# EAGLE schematic PCB (beta) (EAGLE 7.7.0)

## Sheet 1 of 12

## Sheet 2 of 12
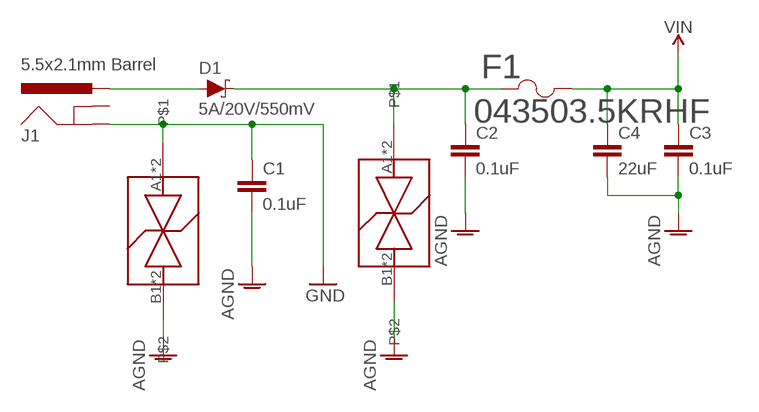
[diagram p0: schematic, sheet 2]

### Parts
C1  0.1uF  0.1UF-0603-25V-(+80/-20%)  [0603]
C2  0.1uF  0.1UF-0603-25V-(+80/-20%)  [0603]
C3  0.1uF  0.1UF-0603-25V-(+80/-20%)  [0603]
C4  22uF  22UF-0805-6.3V-20%  [0805]
D1  5A/20V/550mV  DIODE-SCHOTTKY-B340A  [SMA-DIODE]
F1  043503.5KRHF  [0435SERIES]
J1  5.5x2.1mm Barrel  POWER_JACKSMD  [POWER_JACK_SMD]
U$2  LFTVS18-1F3_FLIPCHIP  [4-UFBGA]
U$3  LFTVS18-1F3_FLIPCHIP  [4-UFBGA]

### Nets
+VDC_IN_F: C2.1 D1.C F1.1
+VDC_IN_F_D: D1.A J1.VIN0(PWR)
AGND: C1.2 C2.2 C3.2 C4.2 ; also sheet 7,8,9,12
GND: C1.1 J1.P$4(GND) ; also sheet 3,4,5,6,7,9
VIN: C3.1 C4.1 F1.2
Unconnected: J1.GND(GNDBREAK) U$2.A1 U$2.A2 U$2.B1 U$2.B2 U$3.A1 U$3.A2 U$3.B1 U$3.B2

## Sheet 3 of 12
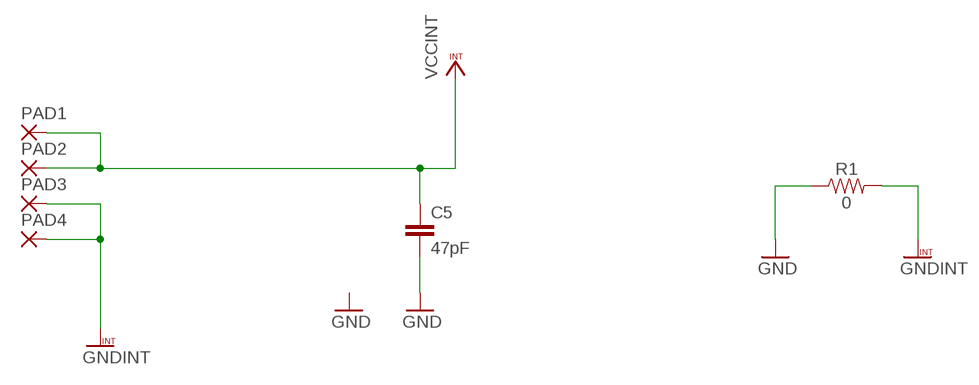
[diagram p1: schematic, sheet 3]

### Parts
C5  47pF  47PF-0603-50V-5%  [0603]
PAD1  2,54/1,0  [2,54/1,0]
PAD2  2,54/1,0  [2,54/1,0]
PAD3  2,54/1,0  [2,54/1,0]
PAD4  2,54/1,0  [2,54/1,0]
R1  0  0OHM-0603-1/10W-5%  [0603]

### Nets
GND: C5.2 R1.1 ; also sheet 2,4,5,6,7,9
GNDINT: PAD3.1(P) PAD4.1(P) R1.2
VCCINT: C5.1 PAD1.1(P) PAD2.1(P)

## Sheet 4 of 12
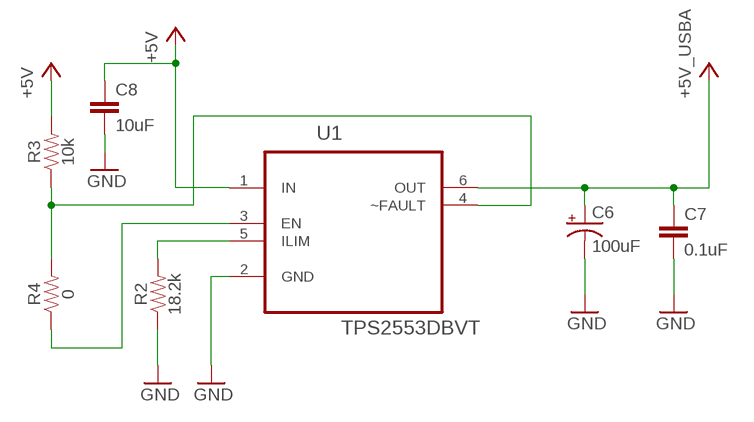
[diagram p2: schematic, sheet 4]

### Parts
C6  100uF  100UF-POLAR-EIA7343-10V-10%(TANT)  [EIA7343]
C7  0.1uF  0.1UF-0603-25V-(+80/-20%)  [0603]
C8  10uF  10UF-0603-6.3V-20%  [0603]
R2  18.2k  1.8KOHM-0603-1/10W-1%  [0603]
R3  10k  10KOHM-0603-1/10W-1%  [0603]
R4  0  0OHM-0603-1/10W-5%  [0603]
U1  TPS2553DBVT  [SOT95P280X145-6N]

### Nets
+5V: C6.A(+) C7.1 C8.1 R3.2 U1.1(IN) U1.6(OUT) ; supply symbol labelled +5V_USBA ; also sheet 9
GND: C6.C(-) C7.2 C8.2 R2.1 U1.2(GND) ; also sheet 2,3,5,6,7,9
N$5: R2.2 U1.5(ILIM)
USB3_CONN_EN: R4.1 U1.3(EN)
USB3_CONN_FLT: R3.1 R4.2 U1.4(~FAULT)

## Sheet 5 of 12
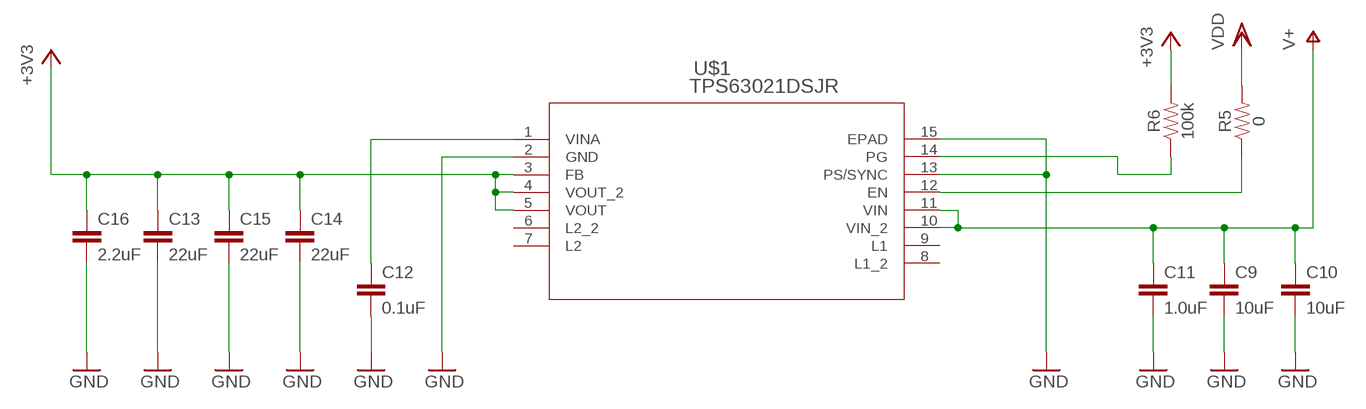
[diagram p3: schematic, sheet 5]

### Parts
C9  10uF  10UF-0603-6.3V-20%  [0603]
C10  10uF  10UF-0603-6.3V-20%  [0603]
C11  1.0uF  1.0UF-0603-16V-10%  [0603]
C12  0.1uF  0.1UF-0603-25V-(+80/-20%)  [0603]
C13  22uF  22UF-0805-6.3V-20%  [0805]
C14  22uF  22UF-0805-6.3V-20%  [0805]
C15  22uF  22UF-0805-6.3V-20%  [0805]
C16  2.2uF  2.2UF-0603-10V-20%  [0603]
R5  0  0OHM-0603-1/10W-5%  [0603]
R6  100k  100KOHM-0603-1/10W-1%  [0603]
U$1  TPS63021DSJR  [DSJ14_2P85X1P58]

### Nets
+3V3: C13.1 C14.1 C15.1 C16.1 R6.2 U$1.3(FB) U$1.4(VOUT_2) U$1.5(VOUT) ; also sheet 7,9
GND: C9.2 C10.2 C11.2 C12.2 C13.2 C14.2 C15.2 C16.2 U$1.2(GND) U$1.13(PS/SYNC) U$1.15(EPAD) ; also sheet 2,3,4,6,7,9
N$1: R5.1 U$1.12(EN)
N$2: R6.1 U$1.14(PG)
N$3: C12.1 U$1.1(VINA)
V+: C9.1 C10.1 C11.1 U$1.10(VIN_2) U$1.11(VIN)
VDD: R5.2
Unconnected: U$1.6(L2_2) U$1.7(L2) U$1.8(L1_2) U$1.9(L1)

## Sheet 6 of 12
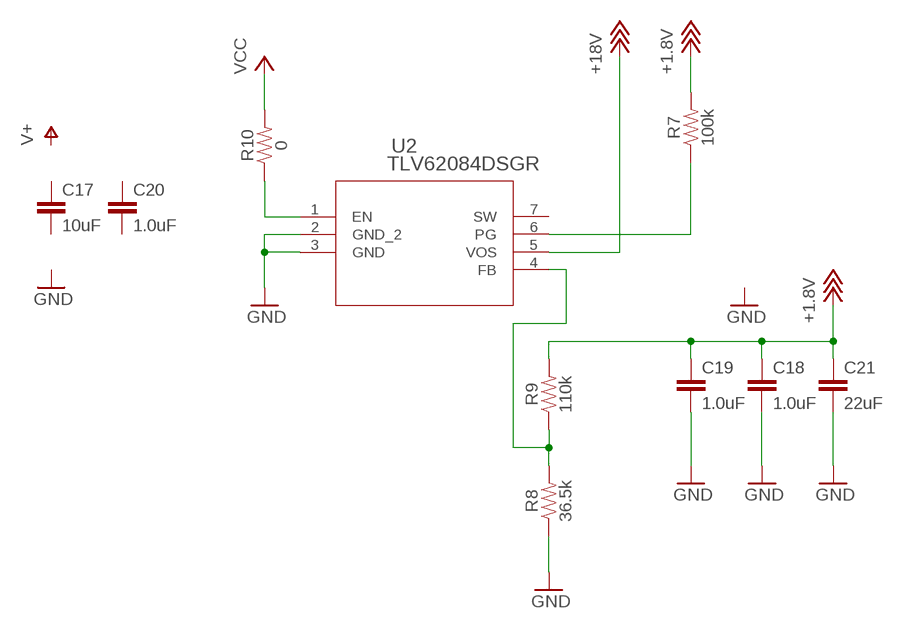
[diagram p4: schematic, sheet 6]

### Parts
C17  10uF  10UF-0603-6.3V-20%  [0603]
C18  1.0uF  1.0UF-0603-16V-10%  [0603]
C19  1.0uF  1.0UF-0603-16V-10%  [0603]
C20  1.0uF  1.0UF-0603-16V-10%  [0603]
C21  22uF  22UF-0805-6.3V-20%  [0805]
R7  100k  100KOHM-0603-1/10W-1%  [0603]
R8  36.5k  2.2OHM-0603-1/10W-5%  [0603]
R9  110k  100KOHM-0603-1/10W-1%  [0603]
R10  0  0OHM-0603-1/10W-5%  [0603]
U2  TLV62084DSGR  [DSG8_0P9X1P6]

### Nets
+18V: C18.1 C19.1 C21.1 R7.2 R9.2 U2.5(VOS) ; supply symbol labelled +1.8V ; also sheet 9
EN_1P8V: R10.1 U2.1(EN)
FB_1P8V: R8.2 R9.1 U2.4(FB)
GND: C18.2 C19.2 C21.2 R8.1 U2.2(GND_2) U2.3(GND) ; also sheet 2,3,4,5,7,9
PWRGOOD_1P8V: R7.1 U2.6(PG)
VCC: R10.2
Unconnected: C17.1 C17.2 C20.1 C20.2 U2.7(SW)

## Sheet 7 of 12
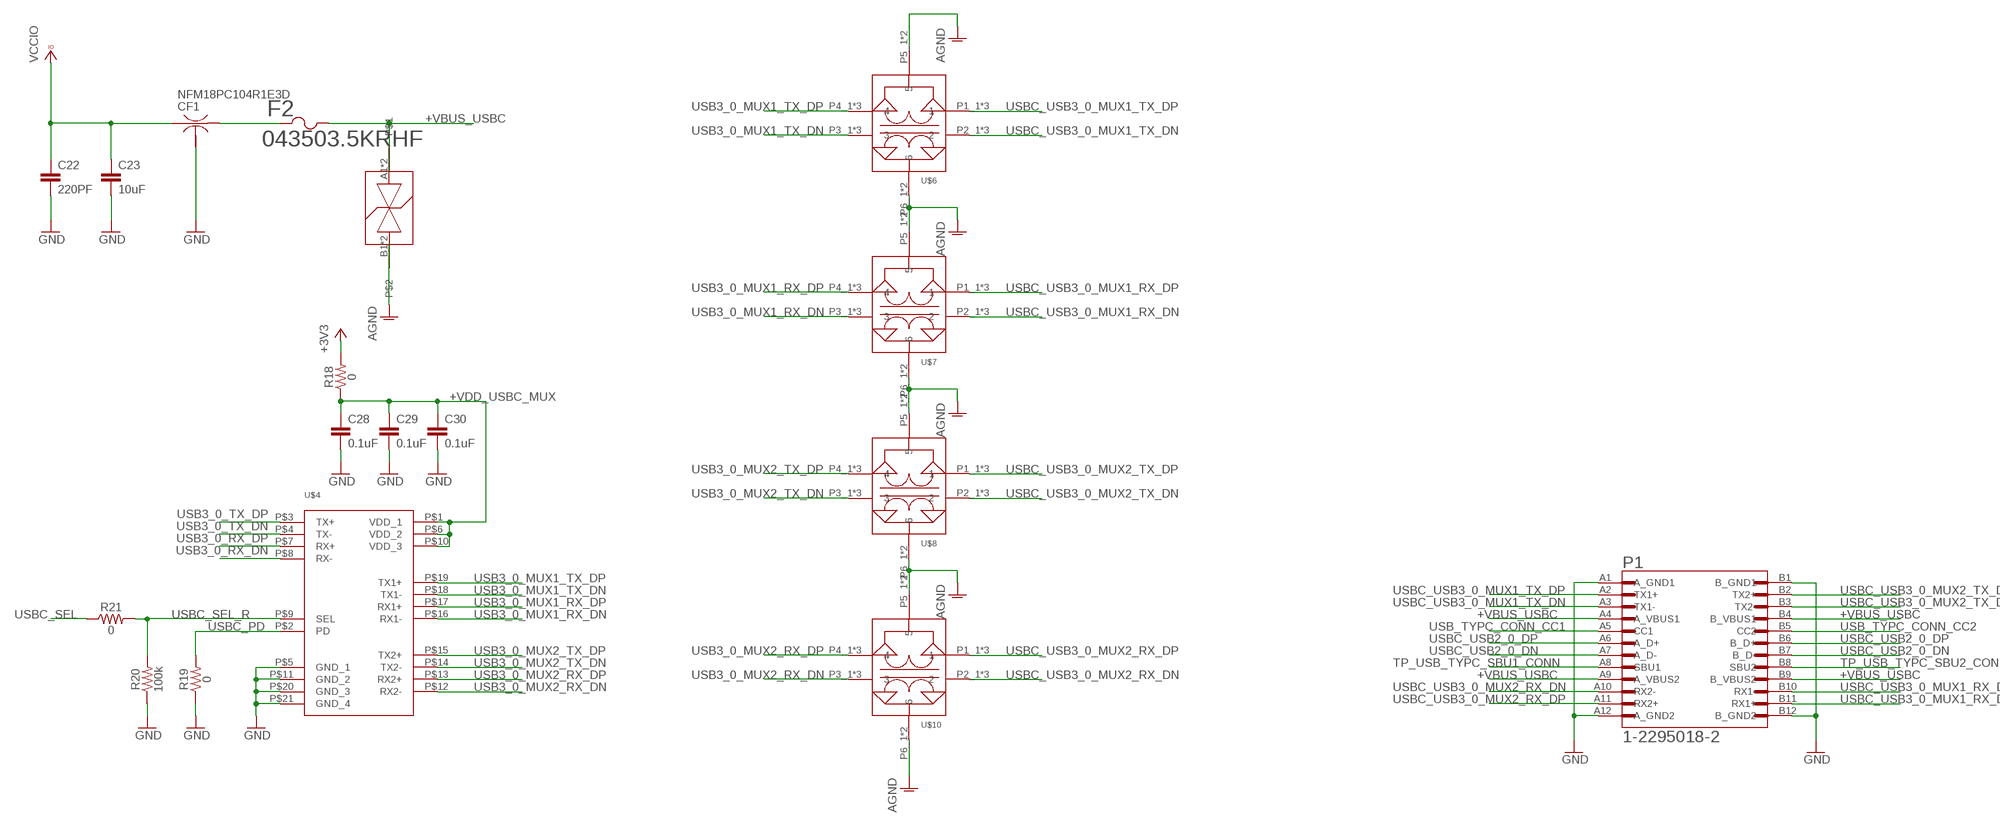
[diagram p5: schematic, sheet 7]

### Parts
C22  220PF  270PF-0603-50V-5%  [0603]
C23  10uF  10UF-0603-6.3V-20%  [0603]
C28  0.1uF  0.1UF-0603-25V-(+80/-20%)  [0603]
C29  0.1uF  0.1UF-0603-25V-(+80/-20%)  [0603]
C30  0.1uF  0.1UF-0603-25V-(+80/-20%)  [0603]
CF1  NFM18PC104R1E3D  NFM21C  [NFM21C]
F2  043503.5KRHF  [0435SERIES]
P1  1-2295018-2  [TE_1-2295018-2]
R18  0  0OHM-0603-1/10W-5%  [0603]
R19  0  0OHM-0603-1/10W-5%  [0603]
R20  100k  100KOHM-0603-1/10W-1%  [0603]
R21  0  0OHM-0603-1/10W-5%  [0603]
U$4  PI3USB302-AZBEX_ANALOG_SWITCH  [20-TQFP]
U$5  LFTVS18-1F3_FLIPCHIP  [4-UFBGA]
U$6  TCE0806S-350-2P-T200  [0302_(0806_METRIC)]
U$7  TCE0806S-350-2P-T200  [0302_(0806_METRIC)]
U$8  TCE0806S-350-2P-T200  [0302_(0806_METRIC)]
U$10  TCE0806S-350-2P-T200  [0302_(0806_METRIC)]

### Nets
+3V3: R18.2 ; also sheet 5,9
+VBUS_USBC: F2.2 P1.A4(A_VBUS1) P1.A9(A_VBUS2) P1.B4(B_VBUS1) P1.B9(B_VBUS2) U$5.A1 U$5.A2
+VBUS_USBC_F: CF1.3 F2.1
+VDD_USBC_MUX: C28.1 C29.1 C30.1 R18.1 U$4.P$1(VDD_1) U$4.P$6(VDD_2) U$4.P$10(VDD_3)
AGND: U$5.B1 U$5.B2 U$6.P5_1 U$6.P5_2 U$6.P6_1 U$6.P6_2 U$7.P5_1 U$7.P5_2 U$7.P6_1 U$7.P6_2 U$8.P5_1 U$8.P5_2 U$8.P6_1 U$8.P6_2 U$10.P5_1 U$10.P5_2 U$10.P6_1 U$10.P6_2 ; also sheet 2,8,9,12
GND: C22.2 C23.2 C28.2 C29.2 C30.2 CF1.2@1 P1.A1(A_GND1) P1.A12(A_GND2) P1.B1(B_GND1) P1.B12(B_GND2) R19.1 R20.1 U$4.P$5(GND_1) U$4.P$11(GND_2) U$4.P$20(GND_3) U$4.P$21(GND_4) ; also sheet 2,3,4,5,6,9
TP_USB_TYPC_SBU1_CONN: P1.A8(SBU1)
TP_USB_TYPC_SBU2_CONN: P1.B8(SBU2)
USB3_0_MUX1_RX_DN: U$4.P$16(RX1-) U$7.P3_1 U$7.P3_2 U$7.P3_3
USB3_0_MUX1_RX_DP: U$4.P$17(RX1+) U$7.P4_1 U$7.P4_2 U$7.P4_3
USB3_0_MUX1_TX_DN: U$4.P$18(TX1-) U$6.P3_1 U$6.P3_2 U$6.P3_3
USB3_0_MUX1_TX_DP: U$4.P$19(TX1+) U$6.P4_1 U$6.P4_2 U$6.P4_3
USB3_0_MUX2_RX_DN: U$4.P$12(RX2-) U$10.P3_1 U$10.P3_2 U$10.P3_3
USB3_0_MUX2_RX_DP: U$4.P$13(RX2+) U$10.P4_1 U$10.P4_2 U$10.P4_3
USB3_0_MUX2_TX_DN: U$4.P$14(TX2-) U$8.P3_1 U$8.P3_2 U$8.P3_3
USB3_0_MUX2_TX_DP: U$4.P$15(TX2+) U$8.P4_1 U$8.P4_2 U$8.P4_3
USB3_0_RX_DN: U$4.P$8(RX-)
USB3_0_RX_DP: U$4.P$7(RX+)
USB3_0_TX_DN: U$4.P$4(TX-)
USB3_0_TX_DP: U$4.P$3(TX+)
USB_TYPC_CONN_CC1: P1.A5(CC1)
USB_TYPC_CONN_CC2: P1.B5(CC2)
USBC_PD: R19.2 U$4.P$2(PD)
USBC_SEL: R21.1
USBC_SEL_R: R20.2 R21.2 U$4.P$9(SEL)
USBC_USB2_0_DN: P1.A7(A_D-) P1.B7(B_D-)
USBC_USB2_0_DP: P1.A6(A_D+) P1.B6(B_D+)
USBC_USB3_0_MUX1_RX_DN: P1.B10(RX1-) U$7.P2_1 U$7.P2_2 U$7.P2_3
USBC_USB3_0_MUX1_RX_DP: P1.B11(RX1+) U$7.P1_1 U$7.P1_2 U$7.P1_3
USBC_USB3_0_MUX1_TX_DN: P1.A3(TX1-) U$6.P2_1 U$6.P2_2 U$6.P2_3
USBC_USB3_0_MUX1_TX_DP: P1.A2(TX1+) U$6.P1_1 U$6.P1_2 U$6.P1_3
USBC_USB3_0_MUX2_RX_DN: P1.A10(RX2-) U$10.P2_1 U$10.P2_2 U$10.P2_3
USBC_USB3_0_MUX2_RX_DP: P1.A11(RX2+) U$10.P1_1 U$10.P1_2 U$10.P1_3
USBC_USB3_0_MUX2_TX_DN: P1.B3(TX2-) U$8.P2_1 U$8.P2_2 U$8.P2_3
USBC_USB3_0_MUX2_TX_DP: P1.B2(TX2+) U$8.P1_1 U$8.P1_2 U$8.P1_3
VCCIO: C22.1 C23.1 CF1.1
Unconnected: CF1.2@2

## Sheet 8 of 12
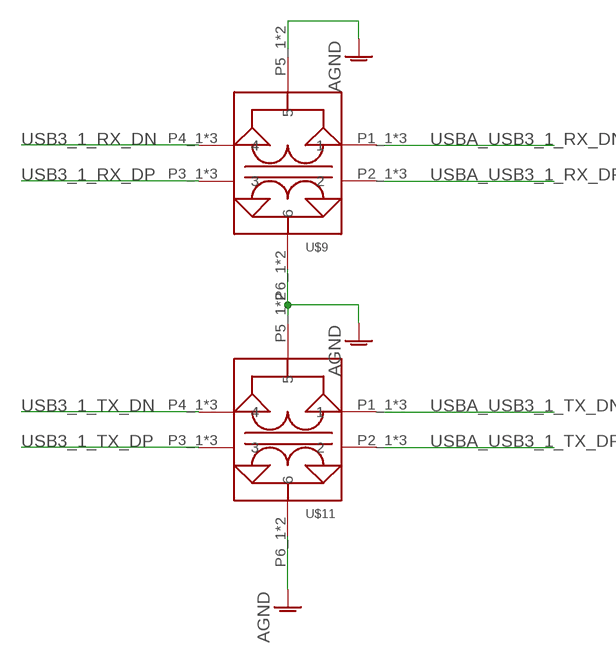
[diagram p6: schematic, sheet 8]

### Parts
U$9  TCE0806S-350-2P-T200  [0302_(0806_METRIC)]
U$11  TCE0806S-350-2P-T200  [0302_(0806_METRIC)]

### Nets
AGND: U$9.P5_1 U$9.P5_2 U$9.P6_1 U$9.P6_2 U$11.P5_1 U$11.P5_2 U$11.P6_1 U$11.P6_2 ; also sheet 2,7,9,12
USB3_1_RX_DN: U$9.P4_1 U$9.P4_2 U$9.P4_3
USB3_1_RX_DP: U$9.P3_1 U$9.P3_2 U$9.P3_3
USB3_1_TX_DN: U$11.P4_1 U$11.P4_2 U$11.P4_3
USB3_1_TX_DP: U$11.P3_1 U$11.P3_2 U$11.P3_3
USBA_USB3_1_RX_DN: U$9.P1_1 U$9.P1_2 U$9.P1_3
USBA_USB3_1_RX_DP: U$9.P2_1 U$9.P2_2 U$9.P2_3
USBA_USB3_1_TX_DN: U$11.P1_1 U$11.P1_2 U$11.P1_3
USBA_USB3_1_TX_DP: U$11.P2_1 U$11.P2_2 U$11.P2_3

## Sheet 9 of 12
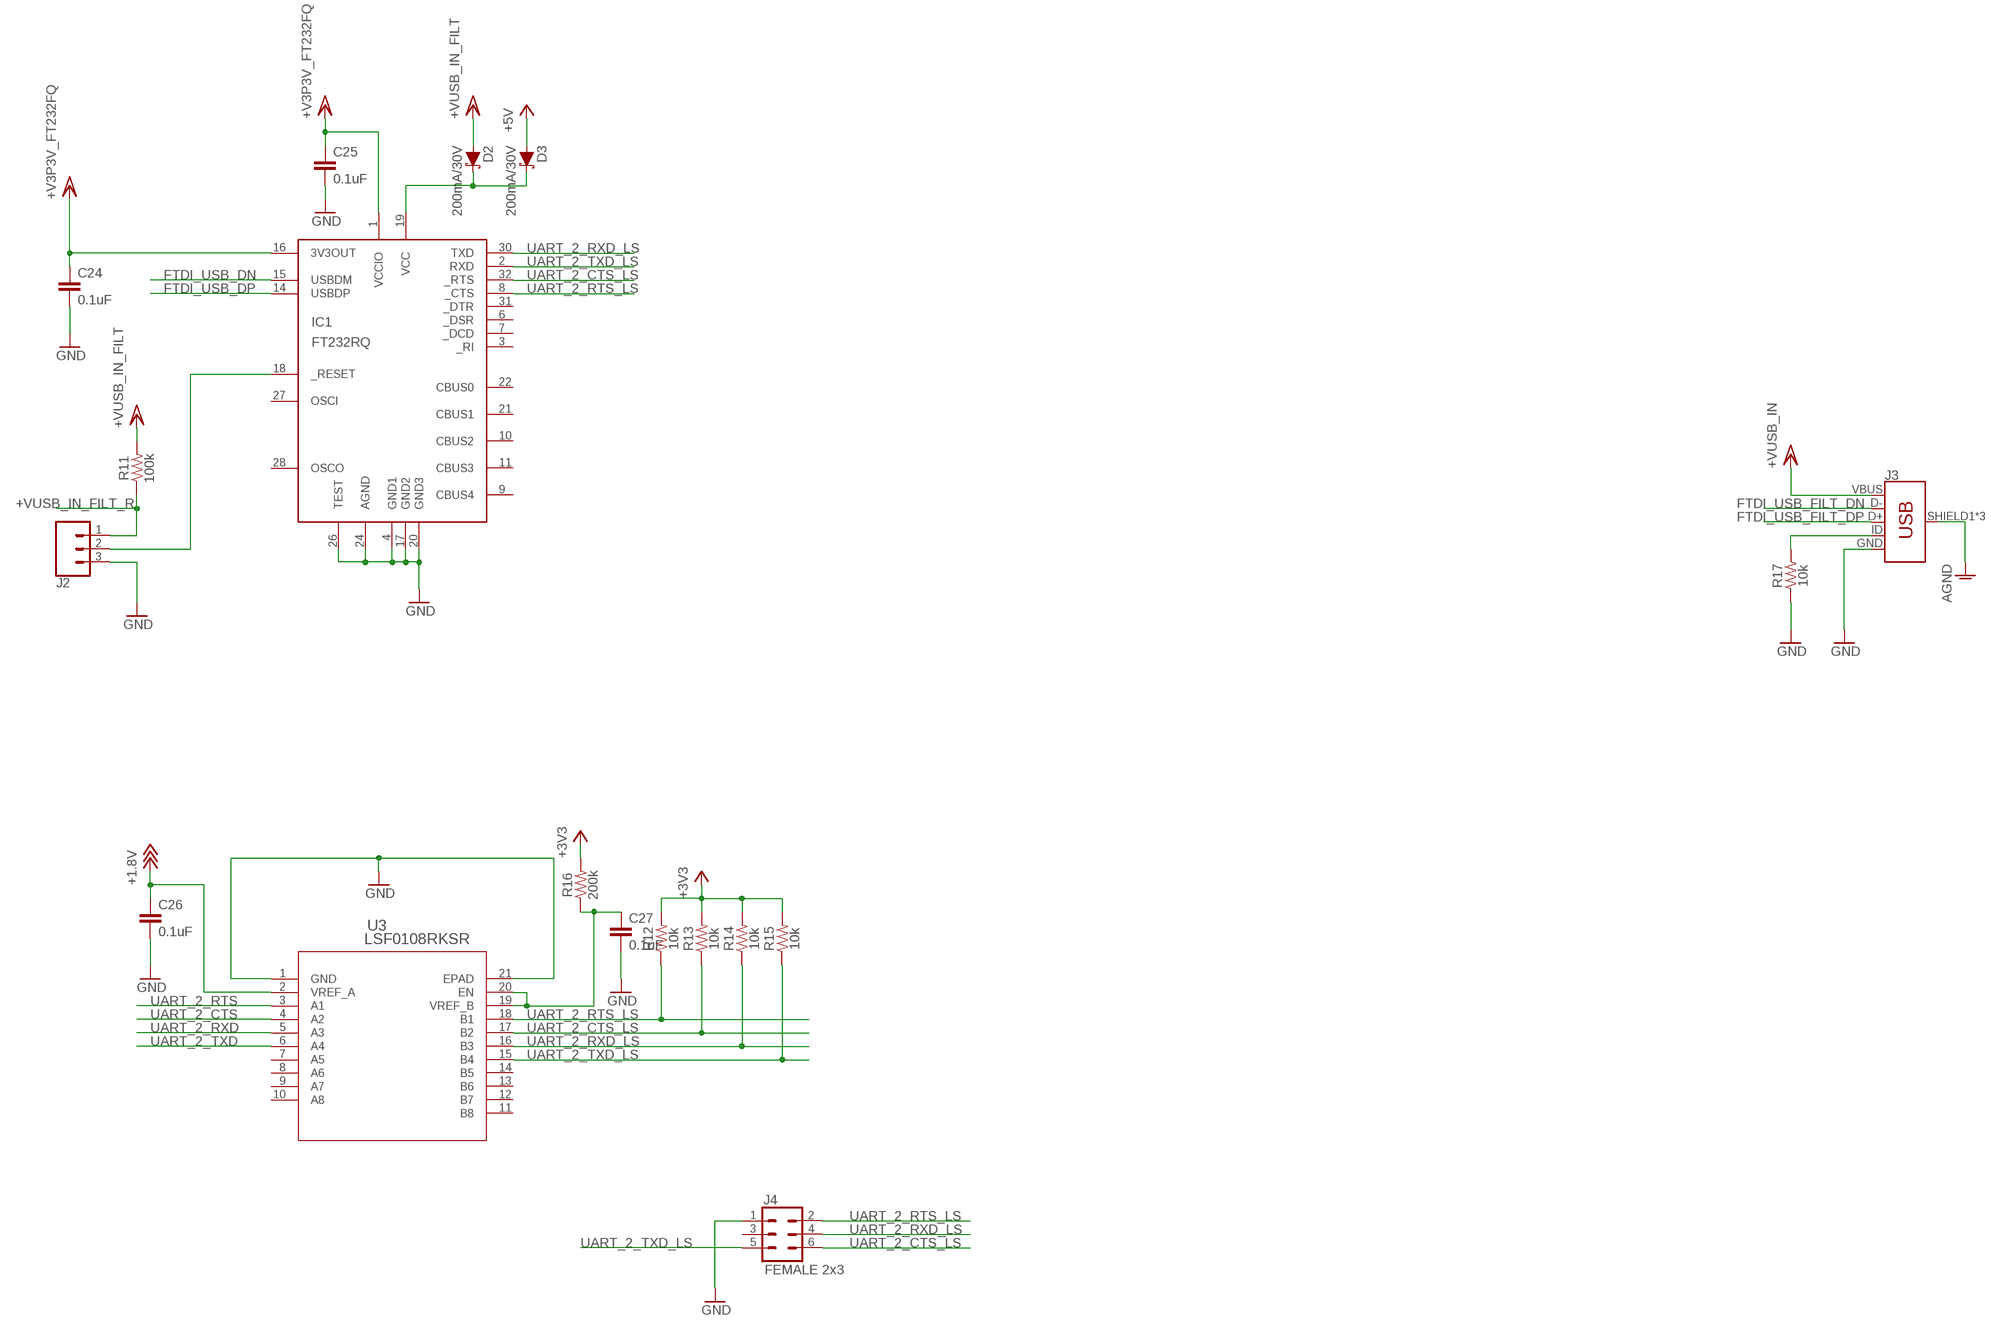
[diagram p7: schematic, sheet 9]

### Parts
C24  0.1uF  0.1UF-0603-25V-(+80/-20%)  [0603]
C25  0.1uF  0.1UF-0603-25V-(+80/-20%)  [0603]
C26  0.1uF  0.1UF-0603-25V-(+80/-20%)  [0603]
C27  0.1uF  0.1UF-0603-25V-(+80/-20%)  [0603]
D2  200mA/30V  DIODE-SCHOTTKY-B340A  [SMA-DIODE]
D3  200mA/30V  DIODE-SCHOTTKY-B340A  [SMA-DIODE]
IC1  FT232RQ  [MLF32]
J2  CONN_03  [1X03]
J3  USB_MICRO-B_FEMALE-SMT  [USB-B-MICRO-SMD]
J4  FEMALE 2x3  CONN_03X2FEMALE  [2X3]
R11  100k  100KOHM-0603-1/10W-1%  [0603]
R12  10k  10KOHM-0603-1/10W-1%  [0603]
R13  10k  10KOHM-0603-1/10W-1%  [0603]
R14  10k  10KOHM-0603-1/10W-1%  [0603]
R15  10k  10KOHM-0603-1/10W-1%  [0603]
R16  200k  200KOHM-0603-1/10W-1%  [0603]
R17  10k  10KOHM-0603-1/10W-1%  [0603]
U3  LSF0108RKSR  [RKS20_1P1X3P1]

### Nets
+3V3: R12.2 R13.2 R14.2 R15.2 R16.2 ; also sheet 5,7
+5V: D3.A ; also sheet 4
+18V: C26.1 U3.2(VREF_A) ; supply symbol labelled +1.8V ; also sheet 6
+VFTDI_VCC_5P0V: D2.C D3.C IC1.19(VCC)
+VUSB_IN_FILT_R: J2.1 R11.1
AGND: J3.SHIELD1(SHIELD) J3.SHIELD2(SHIELD) J3.SHIELD3(SHIELD) ; also sheet 2,7,8,12
FTDI_USB_DN: IC1.15(USBDM)
FTDI_USB_DP: IC1.14(USBDP)
FTDI_USB_FILT_DN: J3.D-
FTDI_USB_FILT_DP: J3.D+
GND: C24.2 C25.2 C26.2 C27.2 IC1.4(GND1) IC1.17(GND2) IC1.20(GND3) IC1.24(AGND) IC1.26(TEST) J2.3 J3.GND J4.1 R17.1 U3.1(GND) U3.21(EPAD) ; also sheet 2,3,4,5,6,7
N$7: J3.ID R17.2
N$16: C27.1 R16.1 U3.19(VREF_B) U3.20(EN)
RST_FT232RQ_N: IC1.18(_RESET) J2.2
UART_2_CTS: U3.4(A2)
UART_2_CTS_LS: IC1.32(_RTS) J4.6 R13.1 U3.17(B2)
UART_2_RTS: U3.3(A1)
UART_2_RTS_LS: IC1.8(_CTS) J4.2 R12.1 U3.18(B1)
UART_2_RXD: U3.5(A3)
UART_2_RXD_LS: IC1.30(TXD) J4.4 R14.1 U3.16(B3)
UART_2_TXD: U3.6(A4)
UART_2_TXD_LS: IC1.2(RXD) J4.5 R15.1 U3.15(B4)
VCC/2: C24.1 C25.1 D2.A IC1.1(VCCIO) IC1.16(3V3OUT) J3.VBUS R11.2 ; supply symbol labelled +V3P3V_FT232FQ, +VUSB_IN_FILT, +VUSB_IN
Unconnected: IC1.3(_RI) IC1.6(_DSR) IC1.7(_DCD) IC1.9(CBUS4) IC1.10(CBUS2) IC1.11(CBUS3) IC1.21(CBUS1) IC1.22(CBUS0) IC1.27(OSCI) IC1.28(OSCO) IC1.31(_DTR) J4.3 U3.7(A5) U3.8(A6) U3.9(A7) U3.10(A8) U3.11(B8) U3.12(B7) U3.13(B6) U3.14(B5)

## Sheet 10 of 12

## Sheet 11 of 12
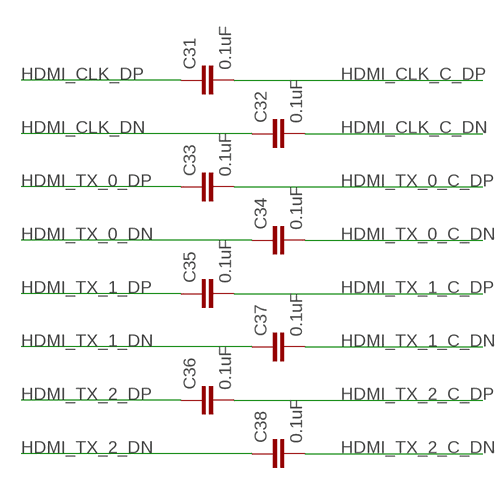
[diagram p8: schematic, sheet 11]

### Parts
C31  0.1uF  0.1UF-0603-25V-(+80/-20%)  [0603]
C32  0.1uF  0.1UF-0603-25V-(+80/-20%)  [0603]
C33  0.1uF  0.1UF-0603-25V-(+80/-20%)  [0603]
C34  0.1uF  0.1UF-0603-25V-(+80/-20%)  [0603]
C35  0.1uF  0.1UF-0603-25V-(+80/-20%)  [0603]
C36  0.1uF  0.1UF-0603-25V-(+80/-20%)  [0603]
C37  0.1uF  0.1UF-0603-25V-(+80/-20%)  [0603]
C38  0.1uF  0.1UF-0603-25V-(+80/-20%)  [0603]

### Nets
HDMI_CLK_C_DN: C32.2
HDMI_CLK_C_DP: C31.2
HDMI_CLK_DN: C32.1
HDMI_CLK_DP: C31.1
HDMI_TX_0_C_DN: C34.2
HDMI_TX_0_C_DP: C33.2
HDMI_TX_0_DN: C34.1
HDMI_TX_0_DP: C33.1
HDMI_TX_1_C_DN: C37.2
HDMI_TX_1_C_DP: C35.2
HDMI_TX_1_DN: C37.1
HDMI_TX_1_DP: C35.1
HDMI_TX_2_C_DN: C38.2
HDMI_TX_2_C_DP: C36.2
HDMI_TX_2_DN: C38.1
HDMI_TX_2_DP: C36.1

## Sheet 12 of 12
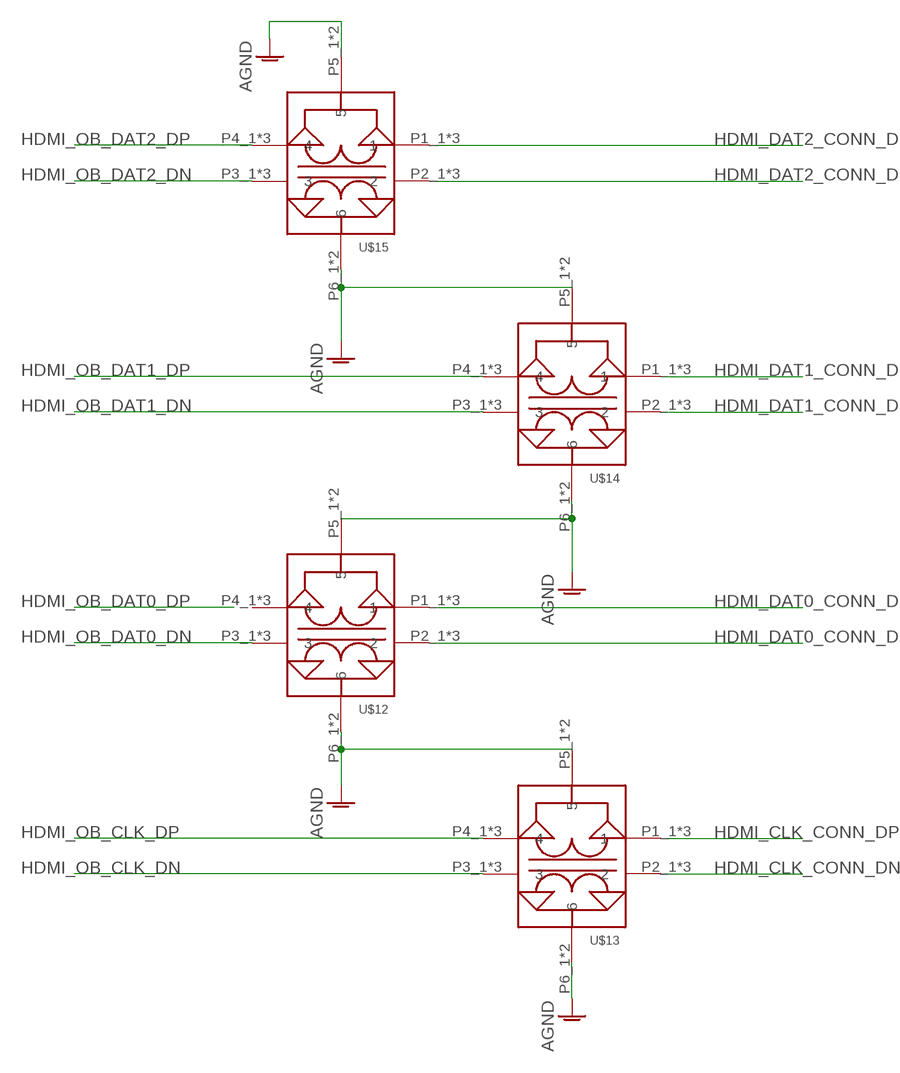
[diagram p9: schematic, sheet 12]

### Parts
U$12  TCE0806G-900-2P-T200  [0302_(0806_METRIC)]
U$13  TCE0806G-900-2P-T200  [0302_(0806_METRIC)]
U$14  TCE0806G-900-2P-T200  [0302_(0806_METRIC)]
U$15  TCE0806G-900-2P-T200  [0302_(0806_METRIC)]

### Nets
AGND: U$12.P5_1 U$12.P5_2 U$12.P6_1 U$12.P6_2 U$13.P5_1 U$13.P5_2 U$13.P6_1 U$13.P6_2 U$14.P5_1 U$14.P5_2 U$14.P6_1 U$14.P6_2 U$15.P5_1 U$15.P5_2 U$15.P6_1 U$15.P6_2 ; also sheet 2,7,8,9
HDMI_CLK_CONN_DN: U$13.P2_1 U$13.P2_2 U$13.P2_3
HDMI_CLK_CONN_DP: U$13.P1_1 U$13.P1_2 U$13.P1_3
HDMI_DAT0_CONN_DN: U$12.P2_1 U$12.P2_2 U$12.P2_3
HDMI_DAT0_CONN_DP: U$12.P1_1 U$12.P1_2 U$12.P1_3
HDMI_DAT1_CONN_DN: U$14.P2_1 U$14.P2_2 U$14.P2_3
HDMI_DAT1_CONN_DP: U$14.P1_1 U$14.P1_2 U$14.P1_3
HDMI_DAT2_CONN_DN: U$15.P2_1 U$15.P2_2 U$15.P2_3
HDMI_DAT2_CONN_DP: U$15.P1_1 U$15.P1_2 U$15.P1_3
HDMI_OB_CLK_DN: U$13.P3_1 U$13.P3_2 U$13.P3_3
HDMI_OB_CLK_DP: U$13.P4_1 U$13.P4_2 U$13.P4_3
HDMI_OB_DAT0_DN: U$12.P3_1 U$12.P3_2 U$12.P3_3
HDMI_OB_DAT1_DN: U$14.P3_1 U$14.P3_2 U$14.P3_3
HDMI_OB_DAT1_DP: U$14.P4_1 U$14.P4_2 U$14.P4_3
HDMI_OB_DAT2_DN: U$15.P3_1 U$15.P3_2 U$15.P3_3
HDMI_OB_DAT2_DP: U$15.P4_1 U$15.P4_2 U$15.P4_3
Unconnected: U$12.P4_1 U$12.P4_2 U$12.P4_3

## Library data of the parts
C1-C3 C7 C12 C24-C38 = SparkFun-Capacitors:0.1UF: 0.1µF ceramic capacitors A capacitor is a passive two-terminal electrical component used to store electrical energy temporarily in an electric field.; PROD_ID: CAP-00810
C4 C13-C15 C21 = SparkFun-Capacitors:22UF: 22µF ceramic capacitors A capacitor is a passive two-terminal electrical component used to store electrical energy temporarily in an electric field.; PROD_ID: CAP-08402
C5 = SparkFun-Capacitors:47PF: 47pF ceramic capacitors A capacitor is a passive two-terminal electrical component used to store electrical energy temporarily in an electric field.; PROD_ID: CAP-08913
C6 = SparkFun-Capacitors:100UF-POLAR: 100µF polarized capacitors A capacitor is a passive two-terminal electrical component used to store electrical energy temporarily in an electric field.; PROD_ID: CAP-07890
C8-C10 C17 C23 = SparkFun-Capacitors:10UF: 10.0µF ceramic capacitors A capacitor is a passive two-terminal electrical component used to store electrical energy temporarily in an electric field.; PROD_ID: CAP-11015
C11 C18-C20 = SparkFun-Capacitors:1.0UF: 1µF ceramic capacitors A capacitor is a passive two-terminal electrical component used to store electrical energy temporarily in an electric field.; PROD_ID: CAP-00868
C16 = SparkFun-Capacitors:2.2UF: 2.2µF ceramic capacitors A capacitor is a passive two-terminal electrical component used to store electrical energy temporarily in an electric field.; PROD_ID: CAP-07888
C22 = SparkFun-Capacitors:270PF: 270pF/0.27nF ceramic capacitors A capacitor is a passive two-terminal electrical component used to store electrical energy temporarily in an electric field.; PROD_ID: CAP-13339; VALUE: 270PF
CF1 = murata-filter:NFM: EMIFIL(R) (Capacitor type) Single Circuit Type for Signal Lines Source: http://search.murata.co.jp/Ceramy/image/img/PDF/ENG/L0111S0109NFM3DC.pdf; MPN: NFM21CC102R1H3D; OC_FARNELL: 1828795; OC_NEWARK: 84R0165
D1-D3 = SparkFun-DiscreteSemi:DIODE-SCHOTTKY: Schottky diode A Schottky diode is a semiconductor diode which has a low forward voltage drop and a very fast switching action.; PROD_ID: DIO-09886; VALUE: 3A/40V/500mV
F1 F2 = DigiKey:043503.5KRHF; MANUFACTURER_PART_NUMBER: 043503.5KRHF; VENDOR: Littelfuse Inc
IC1 = ftdichip-3:FT232RQ: USB UART 4th Generation USB UART (USB <-> Serial) Controller
J1 = SparkFun-Connectors:POWER_JACK: Power Jack Connector This is the standard 5.5mm barrel jack for power. The PTH is the most common, proven, reliable, footprint. The Slot footprint only works if the mill layer is transmitted to the PCB fab house so be warned. Here are the connectors we sell at SparkFun: DC Barrel Power Jack/Connector <https://www.sparkfun.com/products/119> (PRT-00119) DC Barrel Power Jack/Connector (SMD) <https://www.sparkfun.com/products/12748> (PRT-12748) DC Barrel Jack Adapter - Breadboard Compatible <https://www.sparkfun.com/products/10811> (PRT-10811) It is used on this SparkFun product (and many, many others): SparkFun RedBoard - Programmed with Arduino <https://www.sparkfun.com/products/12757> (DEV-12757) Also, if you need a mating power supply or connector, please check these out: Wall Adapter Power Supply - 9VDC 650mA <https://www.sparkfun.com/products/298> (TOL-00298) DC Barrel Jack Adapter - Male <https://www.sparkfun.com/products/10287> (PRT-10287); PROD_ID: CONN-08106; SF_ID: PRT-12748
J2 = SparkFun-Connectors:CONN_03: Multi connection point. Often used as Generic Header-pin footprint for 0.1 inch spaced/style header connections On any of the 0.1 inch spaced packages, you can populate with these: Break Away Headers - Straight <https://www.sparkfun.com/products/116> (PRT-00116) Break Away Male Headers - Right Angle <https://www.sparkfun.com/products/553> (PRT-00553) Female Headers <https://www.sparkfun.com/products/115> (PRT-00115) Break Away Headers - Machine Pin <https://www.sparkfun.com/products/117> (PRT-00117) Break Away Female Headers - Swiss Machine Pin <https://www.sparkfun.com/products/743> (PRT-00743) Stackable Header - 3 Pin (Female, 0.1") <https://www.sparkfun.com/products/13875> (PRT-13875) For SCREWTERMINALS and SPRING TERMINALS visit here: Screw Terimnals on SparkFun.com <https://www.sparkfun.com/search/results?term=Screw+Terminals> (5mm/3.5mm/2.54mm spacing) This device is also useful as a general connection point to wire up your design to another part of your project. Our various solder wires solder well into these plated through hole pads. Hook-Up Wire - Assortment (Stranded, 22 AWG) <https://www.sparkfun.com/products/11375> (PRT-11375) Hook-Up Wire - Assortment (Solid Core, 22 AWG) <https://www.sparkfun.com/products/11367> (PRT-11367) View the entire wire category on our website here <https://www.sparkfun.com/categories/141> Special notes: Molex polarized connector foot print use with SKU : PRT-08232 with associated crimp pins and housings.
J3 = SparkFun-Connectors:USB_MICRO-B: USB Type Micro-B Connector Male/female and PTH/SMT variants SparkFun Products: SparkFun microB USB Breakout <https://www.sparkfun.com/products/12035> SparkFun USB microB Plug Breakout <https://www.sparkfun.com/products/10031> SparkFun ESP8266 Thing <https://www.sparkfun.com/products/13231>; PROD_ID: CONN-11752
J4 = SparkFun-Connectors:CONN_03X2: Multi connection point. Often used as Generic Header-pin footprint for 0.1 inch spaced/style header connections You can populate with any combo of single row headers, but if you'd like an exact match, check these: Header - 2x3 (Male, 0.1") <https://www.sparkfun.com/products/12807> (PRT-12807) Header - 2x3 (Female, 0.1") <https://www.sparkfun.com/products/13010> (PRT-13010) 2x3 Pin Shrouded Header <https://www.sparkfun.com/products/10877> (PRT-10877) On any of the 0.1 inch spaced packages, you can populate with these: Break Away Headers - Straight <https://www.sparkfun.com/products/116> (PRT-00116) Break Away Male Headers - Right Angle <https://www.sparkfun.com/products/553> (PRT-00553) Female Headers <https://www.sparkfun.com/products/115> (PRT-00115) Break Away Headers - Machine Pin <https://www.sparkfun.com/products/117> (PRT-00117) Break Away Female Headers - Swiss Machine Pin <https://www.sparkfun.com/products/743> (PRT-00743) Special note: the shrouded connector mates well with our 3x2 ribbon cables: Ribbon Crimp Connector - 6-pin (2x3, Female) <https://www.sparkfun.com/products/10651> (PRT-10651) Ribbon Cable - 6 wire (15ft) <https://www.sparkfun.com/products/10646> (PRT-10646); PROD_ID: CONN-11566
P1 = 1-2295018-2:1-2295018-2: Conn USB Type C RCP 12 POS Solder RA SMD 12 Terminal 1 Port T/R; AVAILABILITY: Good; DESCRIPTION: Conn USB Type C RCP 12 POS Solder RA SMD 12 Terminal 1 Port T/R; MF: TE Connectivity / AMP; MP: 1-2295018-2; PACKAGE: None; PRICE: 1.83 USD
PAD1-PAD4 = wirepad:2,54/1,0: THROUGH-HOLE PAD
R1 R4 R5 R10 R18 R19 R21 = SparkFun-Resistors:0OHM: 0Ω resistor A resistor is a passive two-terminal electrical component that implements electrical resistance as a circuit element. Resistors act to reduce current flow, and, at the same time, act to lower voltage levels within circuits. - Wikipedia; PROD_ID: RES-08609
R2 = SparkFun-Resistors:1.8KOHM: 1.8kΩ resistor A resistor is a passive two-terminal electrical component that implements electrical resistance as a circuit element. Resistors act to reduce current flow, and, at the same time, act to lower voltage levels within circuits. - Wikipedia; PROD_ID: RES-09119; VALUE: 1.8k
R3 R12-R15 R17 = SparkFun-Resistors:10KOHM: 10kΩ resistor A resistor is a passive two-terminal electrical component that implements electrical resistance as a circuit element. Resistors act to reduce current flow, and, at the same time, act to lower voltage levels within circuits. - Wikipedia; PROD_ID: RES-00824
R6 R7 R11 R20 = SparkFun-Resistors:100KOHM: 100kΩ resistor A resistor is a passive two-terminal electrical component that implements electrical resistance as a circuit element. Resistors act to reduce current flow, and, at the same time, act to lower voltage levels within circuits. - Wikipedia; PROD_ID: RES-07828
R8 = SparkFun-Resistors:2.2OHM: 2.2Ω resistor A resistor is a passive two-terminal electrical component that implements electrical resistance as a circuit element. Resistors act to reduce current flow, and, at the same time, act to lower voltage levels within circuits. - Wikipedia; PROD_ID: RES-07823; VALUE: 2.2
R9 = SparkFun-Resistors:100KOHM: 100kΩ resistor A resistor is a passive two-terminal electrical component that implements electrical resistance as a circuit element. Resistors act to reduce current flow, and, at the same time, act to lower voltage levels within circuits. - Wikipedia; PROD_ID: RES-07828; VALUE: 100k
R16 = SparkFun-Resistors:200KOHM: 200kΩ resistor A resistor is a passive two-terminal electrical component that implements electrical resistance as a circuit element. Resistors act to reduce current flow, and, at the same time, act to lower voltage levels within circuits. - Wikipedia; PROD_ID: RES-09385
U1 = Texas Instruments_By_element14_Batch_1:TPS2553DBVT: PRECISION ADJUSTABLE CURRENT-LIMITED POWER-DISTRIBUTION SWITCHES; MPN: TPS2553DBVT; OC_FARNELL: 1694425; OC_NEWARK: 40P3870; PACKAGE: SOT-23-6; SUPPLIER: Texas Instruments
U2 = DigiKey:TLV62084DSGR; MANUFACTURER_PART_NUMBER: tlv62084dsgr; VENDOR: Texas Instruments
U3 = Joule Expansion Board:LSF0108RKSR; MANUFACTURER_PART_NUMBER: lsf0108rksr; VENDOR: Texas Instruments
U$1 = DigiKey:TPS63021DSJR; MANUFACTURER_PART_NUMBER: TPS63021DSJR; VENDOR: Texas Instruments
U$2 U$3 U$5 = Joule Expansion Board:LFTVS18-1F3_FLIPCHIP
U$4 = Joule Expansion Board:PI3USB302-AZBEX_ANALOG_SWITCH
U$6-U$11 = Joule Expansion Board:TCE0806S-350-2P-T200
U$12-U$15 = Joule Expansion Board:TCE0806G-900-2P-T200